# Altium schematic sheet UWB.SchDoc
size A4
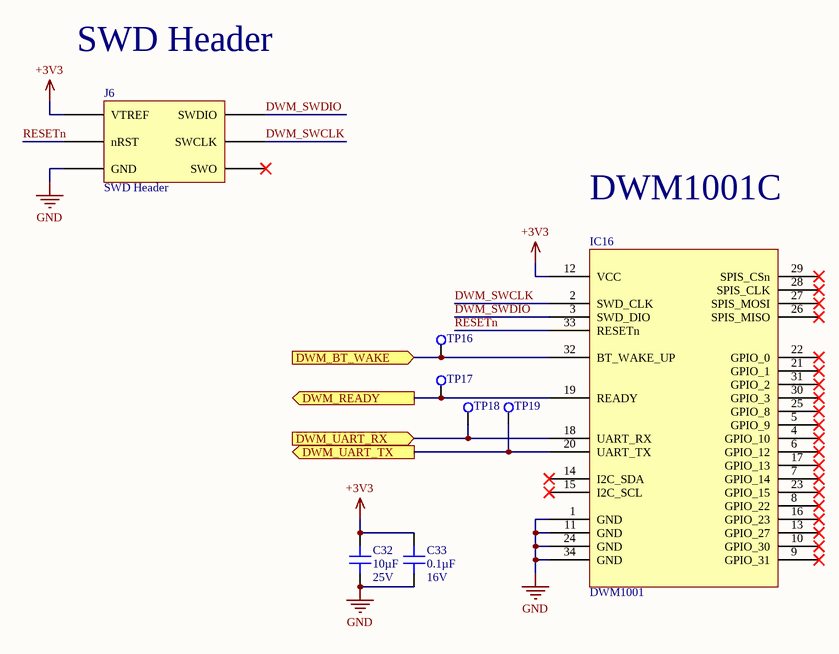
[diagram p0: UWB.SchDoc]

## Parts
C32  Voltage - Rated: 25V  [CAP 0603_1608]  (hidden comment: 10µF)
C33  Voltage - Rated: 16V  [CAP 0603_1608]  (hidden comment: 0.1µF)
IC16  DWM1001  [DWM1001]
J6  SWD Header  [SWD Header]  (no BOM)
TP16  TestPoint  [TestPoint]  (value not drawn)  (no BOM)
TP17  TestPoint  [TestPoint]  (value not drawn)  (no BOM)
TP18  TestPoint  [TestPoint]  (value not drawn)  (no BOM)
TP19  TestPoint  [TestPoint]  (value not drawn)  (no BOM)

## Ports
DWM_BT_WAKE (in), DWM_READY (out), DWM_UART_RX (in), DWM_UART_TX (out)

## Nets
+3V3: C32.2 C33.2 IC16.12(VCC) J6.VTREF
GND: C32.1 C33.1 IC16.1(GND) IC16.11(GND) IC16.24(GND) IC16.34(GND) J6.GND
DWM_BT_WAKE: IC16.32(BT_WAKE_UP) TP16.1 ; port DWM_BT_WAKE
DWM_READY: IC16.19(READY) TP17.1 ; port DWM_READY
DWM_SWCLK: IC16.2(SWD_CLK) J6.SWCLK
DWM_SWDIO: IC16.3(SWD_DIO) J6.SWDIO
DWM_UART_RX: IC16.18(UART_RX) TP18.1 ; port DWM_UART_RX
DWM_UART_TX: IC16.20(UART_TX) TP19.1 ; port DWM_UART_TX
RESETn: IC16.33(RESETn) J6.nRST

Not connected (* = marked no-connect by the designer): IC16 4(GPIO_10)* 5(GPIO_9)* 6(GPIO_12)* 7(GPIO_14)* 8(GPIO_22)* 9(GPIO_31)* 10(GPIO_30)* 13(GPIO_27)* 14(I2C_SDA)* 15(I2C_SCL)* 16(GPIO_23)* 17(GPIO_13)* 21(GPIO_1)* 22(GPIO_0)* 23(GPIO_15)* 25(GPIO_8)* 26(SPIS_MISO)* 27(SPIS_MOSI)* 28(SPIS_CLK)* 29(SPIS_CSn)* 30(GPIO_3)* 31(GPIO_2)*; J6 SWO*

## Notes on the sheet
- SWD Header
- DWM1001C

## Library data of the parts
C32 = CC0603MRX5R8BB106: CAP CER 10UF 25V X5R 0603; Manufacturer: Yageo; Tolerance: ±20%; Part Number: CC0603MRX5R8BB106; Value: 10µF; Applications: General Purpose; Capacitance: 10µF; ComponentLink1Description: Datasheet; ComponentLink1URL: https://www.yageo.com/upload/media/product/productsearch/datasheet/mlcc/UPY-GPHC_X5R_4V-to-50V_25.pdf; ComponentLink2Description: DigiKey Link; ComponentLink2URL: http://digikey.com/product-detail/en/yageo/CC0603MRX5R8BB106/311-3494-1-ND/7164515; Device Package: 0603 (1608 Metric); LastUpdated: 9/2/2020 1:02:55 AM; Lifecycle Status: Active; Minimum Order: 1; Mounting Type: Surface Mount, MLCC; Operating Temperature: -55°C ~ 85°C; Package / Case: 0603 (1608 Metric); Packaging: TapeAndReel; PartId: 27362; Part Status: Active; Price: 0.20; Series: CC; Supplier 1: DigiKey; Supplier Part Number 1: 311-3494-1-ND; Temperature Coefficient: X5R
C33 = CC0603KRX7R7BB104: CAP CER 0.1UF 16V X7R 0603; Manufacturer: Yageo; Tolerance: ±10%; Part Number: CC0603KRX7R7BB104; Value: 0.1µF; Applications: General Purpose; Capacitance: 0.1µF; ComponentLink1Description: Datasheet; ComponentLink1URL: https://www.yageo.com/upload/media/product/productsearch/datasheet/mlcc/UPY-GPHC_X7R_6.3V-to-50V_18.pdf; ComponentLink2Description: DigiKey Link; ComponentLink2URL: http://digikey.com/product-detail/en/yageo/CC0603KRX7R7BB104/311-1088-1-ND/302998; Device Package: 0603 (1608 Metric); LastUpdated: 9/2/2020 1:03:05 AM; Lifecycle Status: Active; Minimum Order: 1; Mounting Type: Surface Mount, MLCC; Operating Temperature: -55°C ~ 125°C; Package / Case: 0603 (1608 Metric); Packaging: TapeAndReel; PartId: 16746; Part Status: Active; Price: 0.01; Series: CC; Size / Dimension: 0.063" L x 0.031" W (1.60mm x 0.80mm); Supplier 1: DigiKey; Supplier Part Number 1: 311-1088-1-ND; Temperature Coefficient: X7R; Thickness (Max): 0.035" (0.90mm)
IC16 = DWM1001: RF TXRX MODULE UWB/BLUETOOTH RTL; Manufacturer: DecaWave; Interface: I2C,SPI,UART; Frequency: 6.5GHz; Data Rate: 6.8Mbps; Supplier 1: Digi-Key; Manufacturer Part Number: DWM1001; RoHS: No; Mount: Surface Mount; Case/Package: SMD/SMT; Packaging: Tape and Reel; ComponentLink1URL: https://www.decawave.com/sites/default/files/dwm1001_system_overview.pdf?src-supplier=Digi-Key; ComponentLink1Description: https://www.decawave.com/sites/default/files/dwm1001_system_overview.pdf?src-supplier=Digi-Key; Supplier Part Number 1: 1479-1004-2-ND